# EAGLE design shitty_dispenser_B (EAGLE 9.6.2)
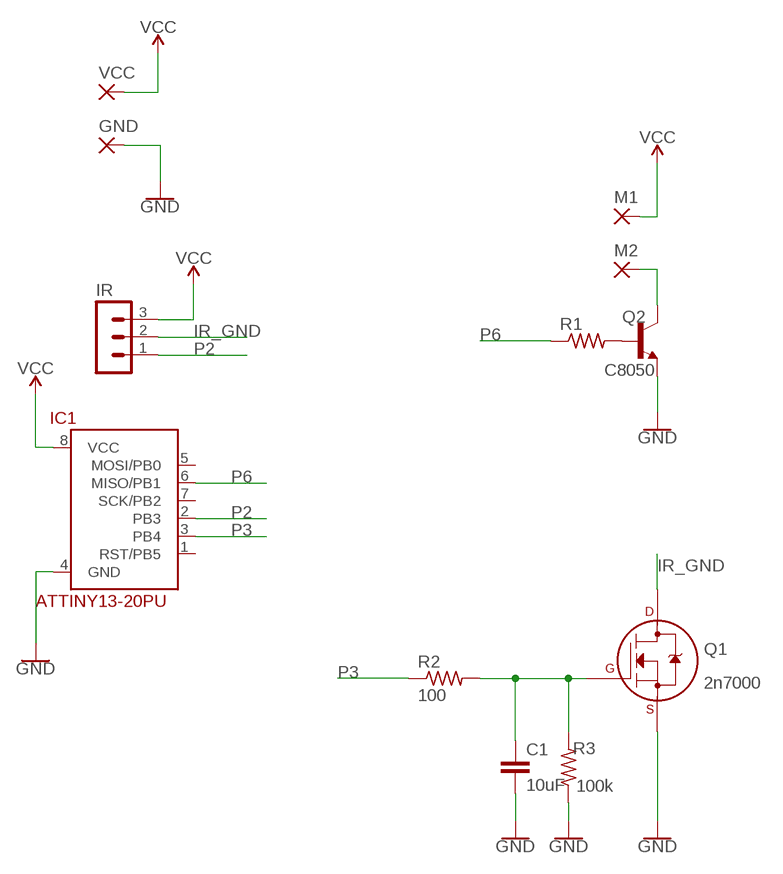
[diagram p0: schematic, sheet 1]

## Parts
C1  10uF  C-EU025-025X050  [C025-025X050]
GND  2,54/1,0  [2,54/1,0]
IC1  ATTINY13-20PU  [DIL08]
IR  MA03-1  [MA03-1]
M1  2,54/1,0  [2,54/1,0]
M2  2,54/1,0  [2,54/1,0]
Q1  2n7000  2N700_TO92-  [TO92-]
Q2  C8050  29-NPN-TO92-EBC  [TO92-EBC]
R1  R-US_0204/7  [0204/7]
R2  100  R-US_0204/7  [0204/7]
R3  100k  R-US_0204/7  [0204/7]
VCC  2,54/1,0  [2,54/1,0]

## Nets
GND: C1.2 GND.1(P) IC1.4(GND) Q1.3(S) Q2.E R3.1
IR_GND: IR.2 Q1.1(D)
N$1: C1.1 Q1.2(G) R2.2 R3.2
N$2: Q2.B R1.2
N$3: M2.1(P) Q2.C
P2: IC1.2(PB3) IR.1
P3: IC1.3(PB4) R2.1
P6: IC1.6(MISO/PB1) R1.1
VCC: IC1.8(VCC) IR.3 M1.1(P) VCC.1(P)
Unconnected: IC1.1(RST/PB5) IC1.5(MOSI/PB0) IC1.7(SCK/PB2)

## Library data of the parts
C1 = rcl:C-EU: CAPACITOR, European symbol; SPICEPREFIX: C
GND VCC = wirepad:2,54/1,0: THROUGH-HOLE PAD
IC1 = attiny13:ATTINY13-20*
IR = con-lstb:MA03-1: PIN HEADER; OC_FARNELL: unknown; OC_NEWARK: unknown
M1 M2 = wirepadB:2,54/1,0: THROUGH-HOLE PAD
Q1 = transistors:2N700*: 2N7000, 2N7002, NDS7002A N-channel enhancement mode MOSFET
Q2 = transistor:*-NPN-: NPN Transistror BF959 corrected 2008.03.06
R1-R3 = rcl:R-US_: RESISTOR, American symbol; SPICEPREFIX: R

## Board
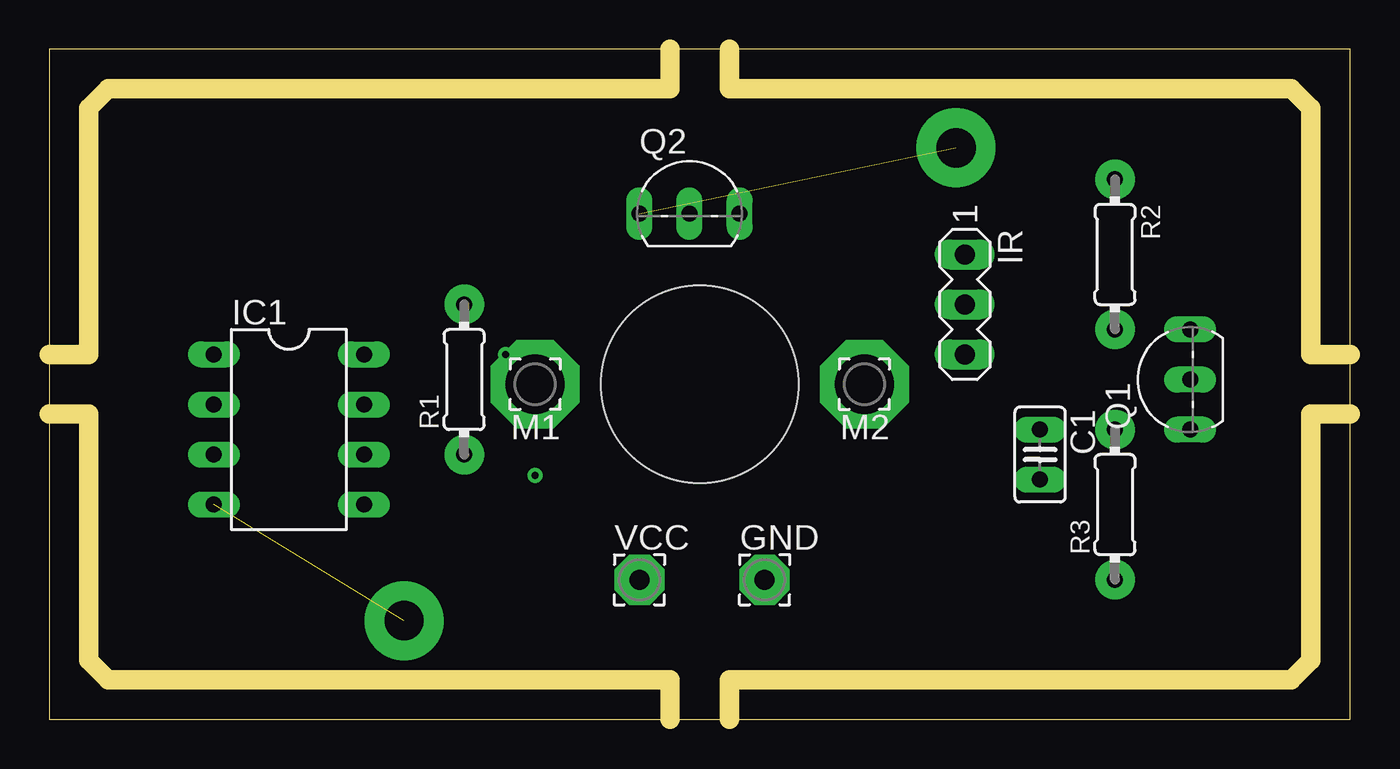
[diagram p1: board, top side]
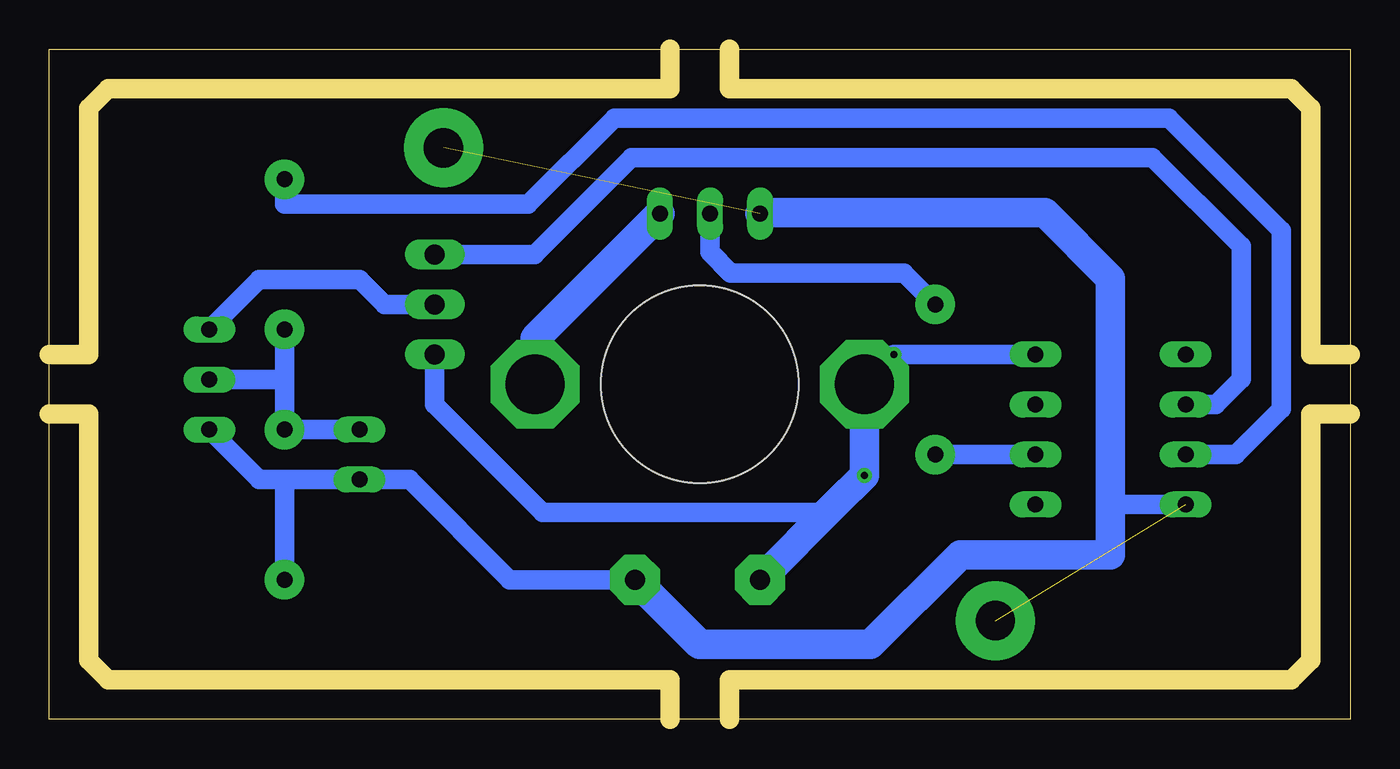
[diagram p2: board, bottom side, seen from below]

Size 66 x 34 mm. Coordinates in mm from the lower left corner, seen from the top.
Outline: 0,0 66,0 66,34 0,34 0,0
Copper layers (1*16): Top 0.035mm / dielectric 1.5mm / Bottom 0.035mm
Design rules "default *": minimum track width 6mil, minimum drill 0.35mm, track to track 1mm, track to pad 1mm, pad to pad 1mm, via to via 6mil, smd to smd 6mil, copper to edge 1mm, drill to drill 6mil, minimum pad ring 10mil, minimum via ring 8mil, stop-mask expansion 4mil, vias tented up to drill 0mil, thermal gap 10mil
Holes 10 mm at 33,17
Milling: 20 lines

### Footprints (pad centres in the part's own frame; a part is rotated, then mirrored left to right if it is on the bottom)
C025-025X050 = drill 0.813 long: 1 -1.27,0; 2 1.27,0
2,54/1,0 = drill 1.016 pad 2.54 octagon: 1 0,0
DIL08 = drill 0.813 long: 1 -3.81,-3.81; 2 -1.27,-3.81; 3 1.27,-3.81; 4 3.81,-3.81; 5 3.81,3.81; 6 1.27,3.81; 7 -1.27,3.81; 8 -3.81,3.81
MA03-1 = drill 1.016 long: 1 -2.54,0; 2 0,0; 3 2.54,0
2,54/1,0' = drill 3 pad 4.5 octagon: 1 0,0
TO92- = drill 0.813 long: 1 2.54,0; 2 0,0; 3 -2.54,0
TO92-EBC = drill 0.813 long: B 0,-1.27; C 2.54,-1.27; E -2.54,-1.27
0204/7 = drill 0.813 pad 2: 1 -3.81,0; 2 3.81,0

### Placement (x,y rotation side)
C1  50.26,13.43 270 top
GND  36.29,7.08 0 top
IC1  12.16,14.7 270 top
IR  46.45,21.05 270 top
M1  [2,54/1,0']  24.65,17 180 top
M2  [2,54/1,0']  41.35,17 180 top
Q1  57.88,17.24 90 top
Q2  32.48,26.93 0 top
R1  21.05,17.24 90 top
R2  54.07,23.59 270 top
R3  54.07,10.89 90 top
VCC  29.94,7.08 0 top

### Tracks (layer width: path | path; a pad name or v marks a point on that pad's centre or on a via)
GND  (via drill 2 pad 4)  (2 unrouted)
  Bottom 1: Q1.3 55.34,12.16 54.07,12.16 | 54.07,12.16 C1.2 47.72,12.16 42.64,7.08 GND.1 | R3.1 54.07,12.16 | IC1.4 12.16,10.89
  Bottom 1.5: GND.1 33.01,3.8 24.33,3.8 19.78,8.35 12.16,8.35 12.16,10.89 12.16,22.36 15.5,25.7 29.9,25.7 Q2.E
  other vias: 18,5 46,29
IR_GND
  Bottom 1: IR.2 48.99,21.05 50.26,22.32 55.34,22.32 Q1.1
N$1
  Bottom 1: R2.2 54.07,17.24 | 54.07,17.24 R3.2 C1.1 | Q1.2 54.07,17.24
N$2
  Bottom 1: Q2.B 32.48,23.7 31.43,22.65 22.65,22.65 R1.2
N$3
  Bottom 1.5: Q2.C 41.35,19.33 M2.1
P2
  Bottom 1: IR.1 41.37,23.59 36.46,28.5 10.03,28.5 5.53,24 5.53,17.27 6.83,15.97 IC1.2
P3
  Bottom 1: R2.1 54.07,26.13 41.7,26.13 37.33,30.5 9.2,30.5 3.5,24.8 3.5,15.74 5.81,13.43 IC1.3
P6
  Bottom 1: IC1.6 R1.1
VCC  (via drill 0.35)
  Bottom 1: IC1.8 v23.14,18.51 M1.1 | IR.3 46.45,15.97 40.98,10.5 26.52,10.5 26.13,10.89
  Bottom 1.5: VCC.1 26.13,10.89 v24.65,12.37 M1.1